# EAGLE board BMS (EAGLE 6.4), part 1 of 2
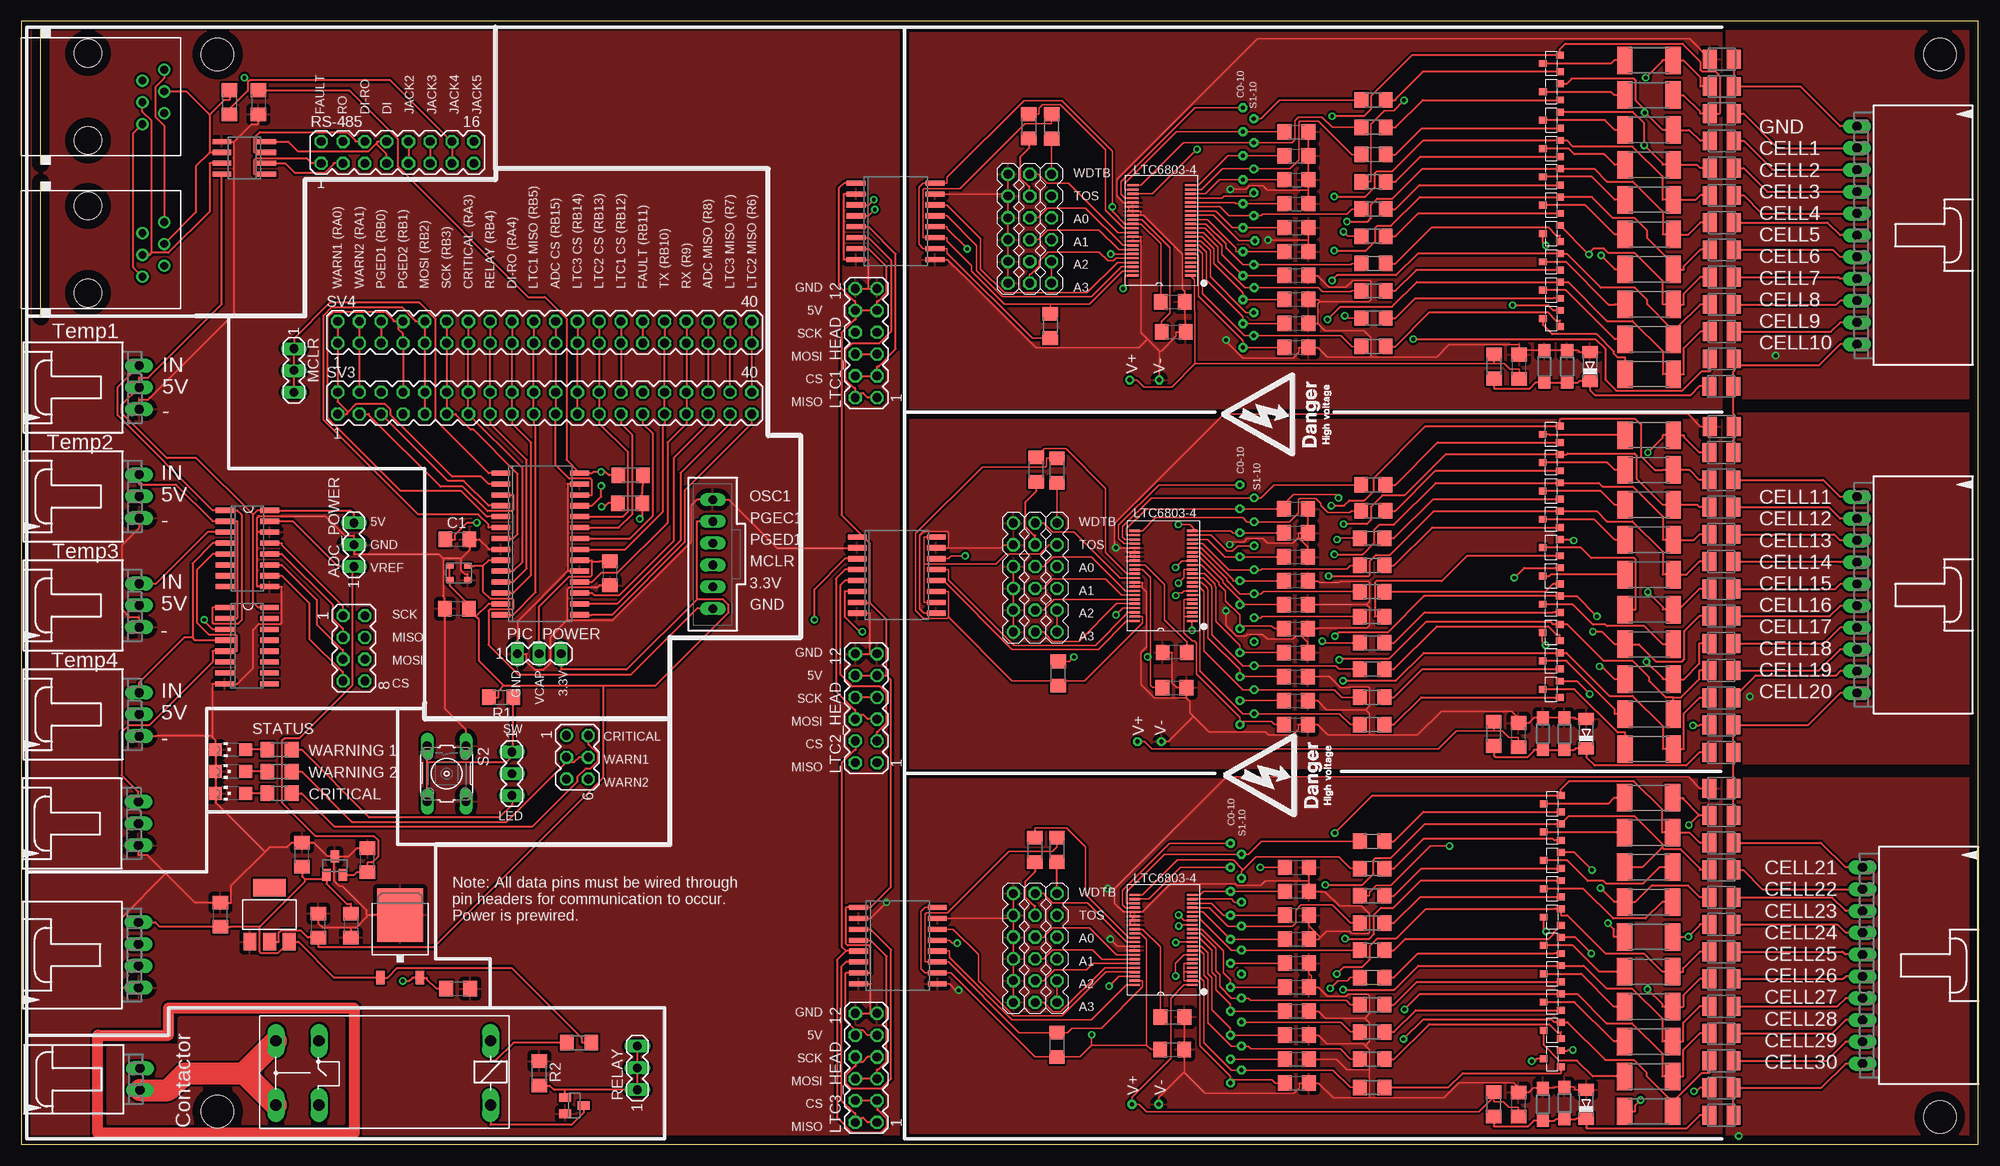
[diagram p12: board, top side]
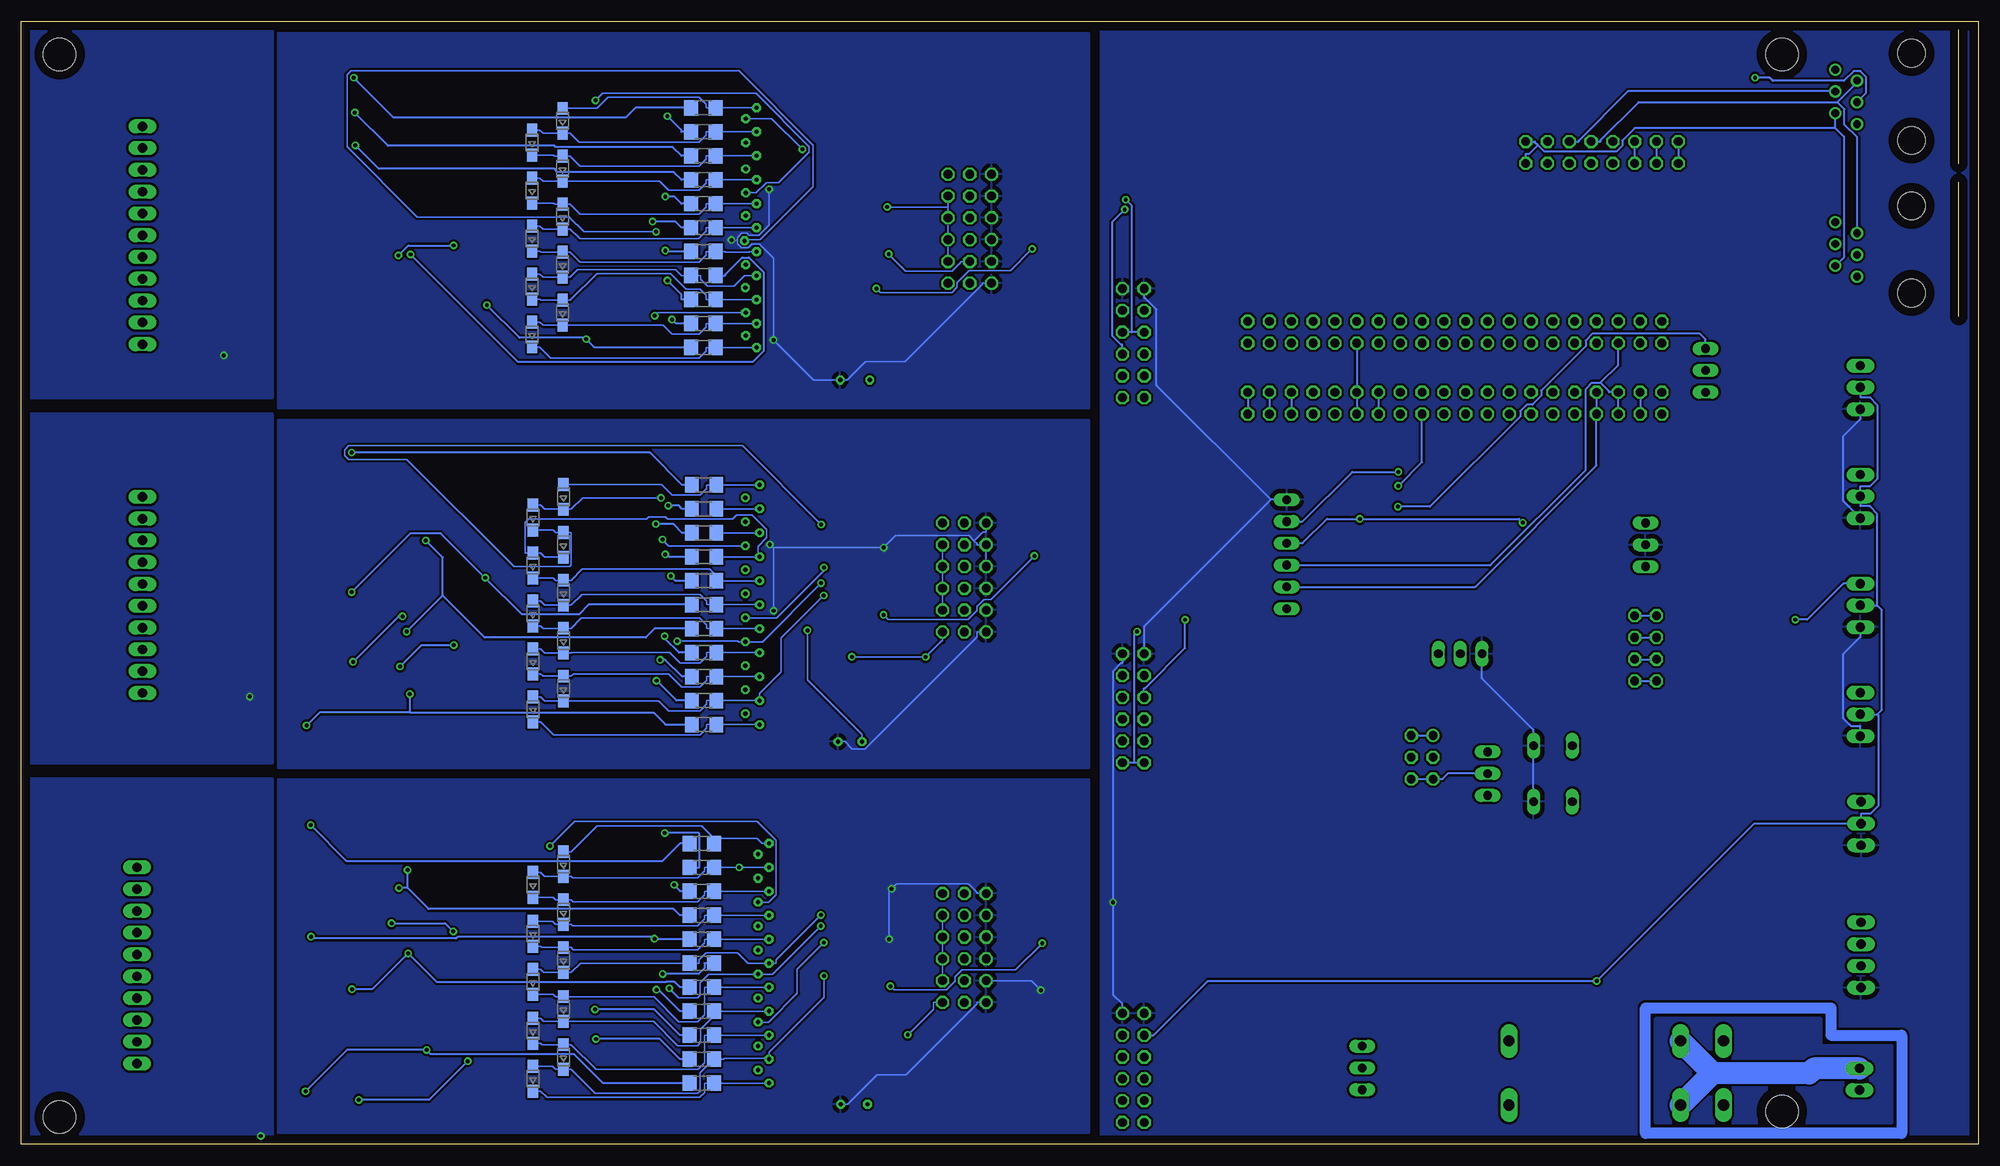
[diagram p13: board, bottom side, seen from below]

Size 227.97 x 130.84 mm. Coordinates in mm from the lower left corner, seen from the top.
Outline: 0,0 227.97,0 227.97,130.84 0,130.84 0,0
Copper layers (1*16): Top 0.035mm / dielectric 1.5mm / Bottom 0.035mm
Design rules "SJ Design Rules *": minimum track width 8mil, minimum drill 18mil, track to track 10mil, track to pad 8mil, pad to pad 8mil, via to via 10mil, smd to smd 8mil, copper to edge 40mil, drill to drill 10mil, minimum pad ring 10mil, minimum via ring 8mil, stop-mask expansion 4mil, vias tented up to drill 0mil, thermal gap 20mil
Net classes: 0 default: width 0.254 mm; 1 Mini: width 0.203 mm
Holes 3.81 mm at 223.52,127 223.52,3.17 22.86,3.81 22.86,127
bKeepout: 6 lines
tRestrict: 3 lines
bRestrict: 2 lines
vRestrict: area 139.2,38.6 to 153.1,47.5; area 139.7,80.2 to 152.7,89.8

## Footprints (pad centres in the part's own frame; a part is rotated, then mirrored left to right if it is on the bottom)
70553-04 = drill 1.092 long: 1 -3.81,-7.62; 2 -1.27,-7.62; 3 1.27,-7.62; 4 3.81,-7.62
MA04-2 = drill 1.016 octagon: 1 -3.81,-1.27; 2 -3.81,1.27; 3 -1.27,-1.27; 4 -1.27,1.27; 5 1.27,-1.27; 6 1.27,1.27; 7 3.81,-1.27; 8 3.81,1.27
MA03-1 = drill 1.016 long: 1 -2.54,0; 2 0,0; 3 2.54,0
70553-03 = drill 1.092 long: 1 -2.54,-7.62; 2 0,-7.62; 3 2.54,-7.62
C1206 = smd 1.6 x 1.8: 1 -1.4,0; 2 1.4,0
70553-10 = drill 1.092 long: 1 -11.43,-7.62; 2 -8.89,-7.62; 3 -6.35,-7.62; 4 -3.81,-7.62; 5 -1.27,-7.62; 6 1.27,-7.62; 7 3.81,-7.62; 8 6.35,-7.62; 9 8.89,-7.62; 10 11.43,-7.62
70553-02 = drill 1.092 long: 1 -1.27,-7.62; 2 1.27,-7.62
SOD323-W = smd 1.5 x 1.2: A 1.45,0; C -1.45,0
MINIMELF = smd 1.4 x 1.8: A 1.7,0; C -1.7,0
SOD123 = smd 1.4 x 1.4: A 1.9,0; C -1.9,0
70553-11 = drill 1.092 long: 1 -12.7,-7.62; 2 -10.16,-7.62; 3 -7.62,-7.62; 4 -5.08,-7.62; 5 -2.54,-7.62; 6 0,-7.62; 7 2.54,-7.62; 8 5.08,-7.62; 9 7.62,-7.62; 10 10.16,-7.62; 11 12.7,-7.62
SO16W = smd 0.6 x 2.2: 1 -4.445,-4.6; 2 -3.175,-4.6; 3 -1.905,-4.6; 4 -0.635,-4.6; 5 0.635,-4.6; 6 1.905,-4.6; 7 3.175,-4.6; 8 4.445,-4.6; 9 4.445,4.6; 10 3.175,4.6; 11 1.905,4.6; 12 0.635,4.6; 13 -0.635,4.6; 14 -1.905,4.6; 15 -3.175,4.6; 16 -4.445,4.6
TO252 = smd 1 x 1.6: 1 -2.28,-4.8; 2 2.28,-4.8 | smd 5.4 x 6.2: 3 0,2.5
SOT223 = smd 1.499 x 2.007: 1 -2.261,-3.15; 2 0.025,-3.15; 3 2.311,-3.15 | smd 3.81 x 2.007: 4 0,3.15
RJ11-NO_SHIELD = drill 0.9 pad 1.4: 1 -3.175,8.89; 2 -1.905,6.35; 3 -0.635,8.89; 4 0.635,6.35; 5 1.905,8.89; 6 3.175,6.35 | hole 3.251: -5.08,0; 5.08,0
G2REA = drill 1.321 long: 1 -2.54,-3.683; 2 -2.54,3.81; P 17.45,-3.683; P@ 17.45,3.81; S 22.454,-3.683; S@ 22.454,3.81
L3225M = smd 1.6 x 2.2: 1 -1.4,0; 2 1.4,0
MA03-2 = drill 1.016: 1 -2.54,-1.27 | drill 1.016 octagon: 2 -2.54,1.27; 3 0,-1.27; 4 0,1.27; 5 2.54,-1.27; 6 2.54,1.27
CHIPLED_1206 = smd 1.5 x 1.5: A 0,-1.75; C 0,1.75
SSOP44 = smd 0.25 x 1.25: P$1 -5.82,-3.33; P$2 -5.32,-3.33; P$3 -4.82,-3.33; P$4 -4.32,-3.33; P$5 -3.82,-3.33; P$6 -3.32,-3.33; P$7 -2.82,-3.33; P$8 -2.32,-3.33; P$9 -1.82,-3.33; P$10 -1.32,-3.33; P$11 -0.82,-3.33; P$12 -0.32,-3.33; P$13 0.18,-3.33; P$14 0.68,-3.33; P$15 1.18,-3.33; P$16 1.68,-3.33; P$17 2.18,-3.33; P$18 2.68,-3.33; P$19 3.18,-3.33; P$20 3.68,-3.33; P$21 4.18,-3.33; P$22 4.68,-3.33; P$23 4.68,3.37; P$24 4.18,3.37; P$25 3.68,3.37; P$26 3.18,3.37; P$27 2.68,3.37; P$28 2.18,3.37; P$29 1.68,3.37; P$30 1.18,3.37; P$31 0.68,3.37; P$32 0.18,3.37; P$33 -0.32,3.37; P$34 -0.82,3.37; P$35 -1.32,3.37; P$36 -1.82,3.37; P$37 -2.32,3.37; P$38 -2.82,3.37; P$39 -3.32,3.37; P$40 -3.82,3.37; P$41 -4.32,3.37; P$42 -4.82,3.37; P$43 -5.32,3.37; P$44 -5.82,3.37
20MIL = drill 0.508 octagon: P$1 0,0
MA06-2 = drill 1.016 octagon: 1 -6.35,-1.27; 2 -6.35,1.27; 3 -3.81,-1.27; 4 -3.81,1.27; 5 -1.27,-1.27; 6 -1.27,1.27; 7 1.27,-1.27; 8 1.27,1.27; 9 3.81,-1.27; 10 3.81,1.27; 11 6.35,-1.27; 12 6.35,1.27
70543-06 = drill 1.016 long: 1 -6.35,0; 2 -3.81,0; 3 -1.27,0; 4 1.27,0; 5 3.81,0; 6 6.35,0
MICRO3 = smd 0.8 x 0.9: 1 -0.95,-1; 2 0.95,-1; 3 0,1
R1206 = smd 1.6 x 1.803: 1 -1.422,0; 2 1.422,0
R2512 = smd 1.8 x 3.2: 1 -2.8,0; 2 2.8,0
MA08-2 = drill 1.016 octagon: 1 -8.89,-1.27; 2 -8.89,1.27; 3 -6.35,-1.27; 4 -6.35,1.27; 5 -3.81,-1.27; 6 -3.81,1.27; 7 -1.27,-1.27; 8 -1.27,1.27; 9 1.27,-1.27; 10 1.27,1.27; 11 3.81,-1.27; 12 3.81,1.27; 13 6.35,-1.27; 14 6.35,1.27; 15 8.89,-1.27; 16 8.89,1.27
B3F-10XX = drill 1.016 long: 1 -3.251,2.261; 2 3.251,2.261; 3 -3.251,-2.261; 4 3.251,-2.261
MA20-2 = drill 1.016 octagon: 1 -24.13,-1.27; 2 -24.13,1.27; 3 -21.59,-1.27; 4 -21.59,1.27; 5 -19.05,-1.27; 6 -19.05,1.27; 7 -16.51,-1.27; 8 -16.51,1.27; 9 -13.97,-1.27; 10 -13.97,1.27; 11 -11.43,-1.27; 12 -11.43,1.27; 13 -8.89,-1.27; 14 -8.89,1.27; 15 -6.35,-1.27; 16 -6.35,1.27; 17 -3.81,-1.27; 18 -3.81,1.27; 19 -1.27,-1.27; 20 -1.27,1.27; 21 1.27,-1.27; 22 1.27,1.27; 23 3.81,-1.27; 24 3.81,1.27; 25 6.35,-1.27; 26 6.35,1.27; 27 8.89,-1.27; 28 8.89,1.27; 29 11.43,-1.27; 30 11.43,1.27; 31 13.97,-1.27; 32 13.97,1.27; 33 16.51,-1.27; 34 16.51,1.27; 35 19.05,-1.27; 36 19.05,1.27; 37 21.59,-1.27; 38 21.59,1.27; 39 24.13,-1.27; 40 24.13,1.27
SOT23 = smd 1 x 1.4: 1 -0.95,-1.1; 2 0.95,-1.1; 3 0,1.1
SO16 = smd 0.6 x 2.2: 1 -4.445,-2.6; 2 -3.175,-2.6; 3 -1.905,-2.6; 4 -0.635,-2.6; 5 0.635,-2.6; 6 1.905,-2.6; 7 3.175,-2.6; 8 4.445,-2.6; 9 4.445,2.6; 10 3.175,2.6; 11 1.905,2.6; 12 0.635,2.6; 13 -0.635,2.6; 14 -1.905,2.6; 15 -3.175,2.6; 16 -4.445,2.6
SO28W = smd 0.6 x 2.2: 1 -8.255,-4.6; 2 -6.985,-4.6; 3 -5.715,-4.6; 4 -4.445,-4.6; 5 -3.175,-4.6; 6 -1.905,-4.6; 7 -0.635,-4.6; 8 0.635,-4.6; 9 1.905,-4.6; 10 3.175,-4.6; 11 4.445,-4.6; 12 5.715,-4.6; 13 6.985,-4.6; 14 8.255,-4.6; 15 8.255,4.6; 16 6.985,4.6; 17 5.715,4.6; 18 4.445,4.6; 19 3.175,4.6; 20 1.905,4.6; 21 0.635,4.6; 22 -0.635,4.6; 23 -1.905,4.6; 24 -3.175,4.6; 25 -4.445,4.6; 26 -5.715,4.6; 27 -6.985,4.6; 28 -8.255,4.6
ASE = smd 0.9 x 0.65: 1 -1.05,-0.825; 2 1.05,-0.825; 3 1.05,0.825; 4 -1.05,0.825
SO-08 = smd 0.6 x 2.2: 1 -1.905,-2.6; 2 -0.635,-2.6; 3 0.635,-2.6; 4 1.905,-2.6; 5 1.905,2.6; 6 0.635,2.6; 7 -0.635,2.6; 8 -1.905,2.6
3ROW_6POS = drill 1.016 octagon: 1 0,0; 2 2.54,0; 3 5.08,0; 4 0,-2.54; 5 2.54,-2.54; 6 5.08,-2.54; 7 0,-5.08; 8 2.54,-5.08; 9 5.08,-5.08; 10 0,-7.62; 11 2.54,-7.62; 12 5.08,-7.62; 13 0,-10.16; 14 2.54,-10.16; 15 5.08,-10.16; 16 0,-12.7; 17 2.54,-12.7; 18 5.08,-12.7

## Placement (x,y rotation side)
12V  C-GRID-04-70553  [70553-04]  6.02,22.05 90 top
ADC_BITS  [MA04-2]  38.73,57.78 270 top
ADC_POWER  [MA03-1]  38.73,69.85 90 top
AIN0  C-GRID-03-70553  [70553-03]  6.1,88.19 90 top
AIN1  C-GRID-03-70553  [70553-03]  6.1,75.49 90 top
AIN2  C-GRID-03-70553  [70553-03]  6.1,62.79 90 top
AIN3  C-GRID-03-70553  [70553-03]  6.1,50.09 90 top
AIN4  C-GRID-03-70553  [70553-03]  5.99,37.36 90 top
C1  1uF  [C1206]  50.8,70.48 0 top
C2  1uF  [C1206]  134.14,98.17 0 top
C4  100nF 100V  [C1206]  148.54,92.84 0 top
C5  100nF 100V  [C1206]  148.54,95.63 0 top
C6  100nF 100V  [C1206]  148.54,98.42 0 top
C7  100nF 100V  [C1206]  148.54,101.22 0 top
C8  100nF 100V  [C1206]  148.54,104.01 0 top
C9  100nF 100V  [C1206]  148.54,106.81 0 top
C10  100nF 100V  [C1206]  148.54,109.6 0 top
C11  100nF 100V  [C1206]  148.54,112.39 0 top
C12  100nF 100V  [C1206]  148.54,115.19 0 top
C13  100nF 100V  [C1206]  148.54,117.98 0 top
C14  100nF 100V  [C1206]  174.5,90.6 90 top
C15  1uF  [C1206]  134.24,94.64 0 top
C16  .1uF  [C1206]  27.61,121.41 270 top
C19  100nF 100V  [C1206]  148.49,48.9 0 top
C20  100nF 100V  [C1206]  148.49,51.69 0 top
C21  100nF 100V  [C1206]  148.49,54.48 0 top
C22  4.7uF  [C1206]  68.58,66.52 270 top
C23  100nF 100V  [C1206]  148.49,57.28 0 top
C24  100nF 100V  [C1206]  148.49,60.07 0 top
C25  100nF 100V  [C1206]  148.49,62.87 0 top
C26  100nF 100V  [C1206]  148.49,65.66 0 top
C27  100nF 100V  [C1206]  148.49,68.45 0 top
C28  100nF 100V  [C1206]  148.49,71.25 0 top
C29  100nF 100V  [C1206]  148.49,74.04 0 top
C30  100nF 100V  [C1206]  174.42,47.68 90 top
C31  1uF  [C1206]  134.34,53.21 0 top
C32  1uF  [C1206]  134.37,57.3 180 top
C35  100nF 100V  [C1206]  148.62,7.11 0 top
C36  100nF 100V  [C1206]  148.62,9.91 0 top
C37  100nF 100V  [C1206]  148.62,12.7 0 top
C38  100nF 100V  [C1206]  148.62,15.49 0 top
C39  100nF 100V  [C1206]  148.62,18.29 0 top
C40  100nF 100V  [C1206]  148.62,21.08 0 top
C41  100nF 100V  [C1206]  148.62,23.88 0 top
C42  100nF 100V  [C1206]  148.62,26.67 0 top
C43  100nF 100V  [C1206]  148.62,29.46 0 top
C44  100nF 100V  [C1206]  148.62,32.26 0 top
C45  100nF 100V  [C1206]  174.42,4.62 90 top
C46  1uF  [C1206]  134.09,11.05 0 top
C47  1uF  [C1206]  134.11,14.83 0 top
C48  .1uF  [C1206]  50.72,62.41 180 top
C49  .1uF  [C1206]  40.31,33.1 90 top
C50  1uF  [C1206]  32.69,33.73 90 top
C51  1uF  [C1206]  23.16,26.75 90 top
C52  .1uF  [C1206]  34.59,25.48 90 top
C53  1uF  [C1206]  38.4,25.48 270 top
C54  .1uF  [C1206]  50.88,18.11 0 top
CELLS-11-20  C-GRID-10-70553  [70553-10]  221.49,64.01 270 top
CELLS-21-30  C-GRID-10-70553  [70553-10]  222.12,20.83 270 top
CONTACTOR  C-GRID-02-70553  [70553-02]  6.2,7.57 90 top
D4  PDZ7.5B  [SOD323-W]  168.38,50.67 90 bottom
D6  PDZ7.5B  [SOD323-W]  168.48,94.36 90 bottom
D7  PDZ7.5B  [SOD323-W]  164.92,96.9 90 bottom
D8  PDZ7.5B  [SOD323-W]  168.48,99.95 90 bottom
D9  PDZ7.5B  [SOD323-W]  164.92,102.49 90 bottom
D10  PDZ7.5B  [SOD323-W]  168.48,105.54 90 bottom
D11  PDZ7.5B  [SOD323-W]  164.92,108.08 90 bottom
D12  PDZ7.5B  [SOD323-W]  168.48,111.12 90 bottom
D13  PDZ7.5B  [SOD323-W]  164.92,113.67 90 bottom
D14  PDZ7.5B  [SOD323-W]  168.48,116.71 90 bottom
D15  PDZ7.5B  [SOD323-W]  164.92,119.25 90 bottom
D16  ZMM5265B-7  [MINIMELF]  182.75,90.63 90 top
D17  BAT46W  [SOD123]  180.09,90.63 90 top
D18  BAT46W  [SOD123]  177.42,90.63 90 top
D19  PDZ7.5B  [SOD323-W]  164.82,53.09 90 bottom
D20  PDZ7.5B  [SOD323-W]  168.38,56.26 90 bottom
D21  PDZ7.5B  [SOD323-W]  164.82,58.67 90 bottom
D22  PDZ7.5B  [SOD323-W]  168.38,61.85 90 bottom
D23  PDZ7.5B  [SOD323-W]  164.82,64.26 90 bottom
D24  PDZ7.5B  [SOD323-W]  168.38,67.44 90 bottom
D25  PDZ7.5B  [SOD323-W]  164.82,69.85 90 bottom
D26  PDZ7.5B  [SOD323-W]  168.38,73.03 90 bottom
D27  PDZ7.5B  [SOD323-W]  164.82,75.44 90 bottom
D28  ZMM5265B-7  [MINIMELF]  182.32,47.83 90 top
D29  BAT46W  [SOD123]  179.78,47.83 90 top
D30  BAT46W  [SOD123]  177.24,47.83 90 top
D33  PDZ7.5B  [SOD323-W]  168.38,7.62 90 bottom
D34  PDZ7.5B  [SOD323-W]  164.82,10.16 90 bottom
D35  PDZ7.5B  [SOD323-W]  168.38,13.21 90 bottom
D36  PDZ7.5B  [SOD323-W]  164.82,15.75 90 bottom
D37  PDZ7.5B  [SOD323-W]  168.38,18.92 90 bottom
D38  PDZ7.5B  [SOD323-W]  164.82,21.46 90 bottom
D39  PDZ7.5B  [SOD323-W]  168.38,24.51 90 bottom
D40  PDZ7.5B  [SOD323-W]  164.82,27.05 90 bottom
D41  PDZ7.5B  [SOD323-W]  168.38,30.23 90 bottom
D42  PDZ7.5B  [SOD323-W]  164.82,32.64 90 bottom
D43  ZMM5265B-7  [MINIMELF]  182.32,4.65 90 top
D44  BAT46W  [SOD123]  177.24,4.65 90 top
D45  BAT46W  [SOD123]  179.78,4.8 90 top
GND-10  C-GRID-11-70553  [70553-11]  221.49,105.92 270 top
IC1  ADUM1401  [SO16W]  101.85,107.54 270 top
IC2  7805DT  [TO252]  44.12,24.21 0 top
IC2_\  ADUM1401  [SO16W]  101.98,66.32 270 top
IC3  REG1117  [SOT223]  28.88,26.75 0 top
IC3_  ADUM1401  [SO16W]  102.11,23.14 270 top
J19  RJ11-2L-B  [RJ11-NO_SHIELD]  7.75,122.05 270 top
J20  RJ11-2L-B  [RJ11-NO_SHIELD]  7.75,104.27 270 top
K1  G2REA  [G2REA]  52.12,8.36 180 top
L5  IMC1210ER100K  [L3225M]  198.12,91.52 180 top
L6  IMC1210ER100K  [L3225M]  198.12,94.69 180 top
L7  IMC1210ER100K  [L3225M]  198.12,97.87 180 top
L8  IMC1210ER100K  [L3225M]  198.12,101.04 180 top
L9  IMC1210ER100K  [L3225M]  198.12,104.22 180 top
L10  IMC1210ER100K  [L3225M]  198.12,107.39 180 top
L11  IMC1210ER100K  [L3225M]  198.12,110.57 180 top
L12  IMC1210ER100K  [L3225M]  198.12,113.74 180 top
L13  IMC1210ER100K  [L3225M]  198.12,116.92 180 top
L14  IMC1210ER100K  [L3225M]  198.12,120.09 180 top
L15  IMC1210ER100K  [L3225M]  198.04,88.32 180 top
L16  IMC1210ER100K  [L3225M]  198.12,126.44 180 top
L17  IMC1210ER100K  [L3225M]  198.12,123.27 180 top
L18  IMC1210ER100K  [L3225M]  198.04,48.84 180 top
L19  IMC1210ER100K  [L3225M]  198.04,52.02 180 top
L20  IMC1210ER100K  [L3225M]  198.04,55.19 180 top
L21  IMC1210ER100K  [L3225M]  198.04,58.37 180 top
L22  IMC1210ER100K  [L3225M]  198.04,61.54 180 top
L23  IMC1210ER100K  [L3225M]  198.04,64.72 180 top
L24  IMC1210ER100K  [L3225M]  198.04,67.89 180 top
L25  IMC1210ER100K  [L3225M]  198.04,71.07 180 top
L26  IMC1210ER100K  [L3225M]  198.04,74.24 180 top
L27  IMC1210ER100K  [L3225M]  198.04,77.42 180 top
L28  IMC1210ER100K  [L3225M]  198.04,45.67 180 top
L29  IMC1210ER100K  [L3225M]  198.12,83.64 180 top
L30  IMC1210ER100K  [L3225M]  198.04,80.59 180 top
L33  IMC1210ER100K  [L3225M]  198.07,6.55 180 top
L34  IMC1210ER100K  [L3225M]  198.07,9.73 180 top
L35  IMC1210ER100K  [L3225M]  198.07,12.9 180 top
L36  IMC1210ER100K  [L3225M]  198.07,16.08 180 top
L37  IMC1210ER100K  [L3225M]  198.07,19.25 180 top
L38  IMC1210ER100K  [L3225M]  198.07,22.43 180 top
L39  IMC1210ER100K  [L3225M]  198.07,25.6 180 top
L40  IMC1210ER100K  [L3225M]  198.07,28.78 180 top
L41  IMC1210ER100K  [L3225M]  198.07,31.95 180 top
L42  IMC1210ER100K  [L3225M]  198.07,35.13 180 top
L43  IMC1210ER100K  [L3225M]  198.07,3.38 180 top
L44  IMC1210ER100K  [L3225M]  198.07,41.48 180 top
L45  IMC1210ER100K  [L3225M]  198.07,38.3 180 top
LED  [MA03-2]  64.77,45.09 270 top
LED37  YELLOW  [CHIPLED_1206]  24.36,43.43 90 top
LED38  RED  [CHIPLED_1206]  24.36,40.89 90 top
LED40  YELLOW  [CHIPLED_1206]  24.36,45.97 90 top
LED_SWITCH  [MA03-1]  57.15,43.18 270 top
LTC1  LTC6803-4  [SSOP44]  132.87,107.06 90 top
LTC1_C0  TESTPAD-20MIL  [20MIL]  142.32,120.78 90 top
LTC1_C1  TESTPAD-20MIL  [20MIL]  142.32,117.98 90 top
LTC1_C2  TESTPAD-20MIL  [20MIL]  142.32,115.19 90 top
LTC1_C3  TESTPAD-20MIL  [20MIL]  142.32,112.39 90 top
LTC1_C4  TESTPAD-20MIL  [20MIL]  142.32,109.6 90 top
LTC1_C5  TESTPAD-20MIL  [20MIL]  142.32,106.81 90 top
LTC1_C6  TESTPAD-20MIL  [20MIL]  142.32,104.01 90 top
LTC1_C7  TESTPAD-20MIL  [20MIL]  142.32,101.22 90 top
LTC1_C8  TESTPAD-20MIL  [20MIL]  142.32,98.42 90 top
LTC1_C9  TESTPAD-20MIL  [20MIL]  142.32,95.63 90 top
LTC1_C10  TESTPAD-20MIL  [20MIL]  142.32,92.84 90 top
LTC1_HEAD  [MA06-2]  98.42,93.34 90 top
LTC1_S1  TESTPAD-20MIL  [20MIL]  143.59,119.51 90 top
LTC1_S2  TESTPAD-20MIL  [20MIL]  143.59,116.71 90 top
LTC1_S3  TESTPAD-20MIL  [20MIL]  143.59,113.67 90 top
LTC1_S4  TESTPAD-20MIL  [20MIL]  143.59,110.87 90 top
LTC1_S5  TESTPAD-20MIL  [20MIL]  143.59,108.2 90 top
LTC1_S6  TESTPAD-20MIL  [20MIL]  143.71,105.28 90 top
LTC1_S7  TESTPAD-20MIL  [20MIL]  143.59,102.49 90 top
LTC1_S8  TESTPAD-20MIL  [20MIL]  143.64,99.82 90 top
LTC1_S9  TESTPAD-20MIL  [20MIL]  143.59,96.9 90 top
LTC1_S10  TESTPAD-20MIL  [20MIL]  143.59,94.23 90 top
LTC1_V+  TESTPAD-20MIL  [20MIL]  129.13,89.05 180 top
LTC1_V-  TESTPAD-20MIL  [20MIL]  132.56,89.05 180 top
LTC2  LTC6803-4  [SSOP44]  133.07,66.8 90 top
LTC2_C0  TESTPAD-20MIL  [20MIL]  141.96,76.83 90 top
LTC2_C1  TESTPAD-20MIL  [20MIL]  141.96,74.04 90 top
LTC2_C2  TESTPAD-20MIL  [20MIL]  141.96,71.25 90 top
LTC2_C3  TESTPAD-20MIL  [20MIL]  141.96,68.45 90 top
LTC2_C4  TESTPAD-20MIL  [20MIL]  141.96,65.66 90 top
LTC2_C5  TESTPAD-20MIL  [20MIL]  141.96,62.87 90 top
LTC2_C6  TESTPAD-20MIL  [20MIL]  141.96,60.07 90 top
LTC2_C7  TESTPAD-20MIL  [20MIL]  141.96,57.28 90 top
LTC2_C8  TESTPAD-20MIL  [20MIL]  141.96,54.48 90 top
LTC2_C9  TESTPAD-20MIL  [20MIL]  141.96,51.69 90 top
LTC2_C10  TESTPAD-20MIL  [20MIL]  141.96,48.9 90 top
LTC2_HEAD  [MA06-2]  98.42,50.8 90 top
LTC2_S1  TESTPAD-20MIL  [20MIL]  143.61,75.31 90 top
LTC2_S2  TESTPAD-20MIL  [20MIL]  143.61,72.52 90 top
LTC2_S3  TESTPAD-20MIL  [20MIL]  143.61,69.72 90 top
LTC2_S4  TESTPAD-20MIL  [20MIL]  143.61,66.93 90 top
LTC2_S5  TESTPAD-20MIL  [20MIL]  143.61,64.14 90 top
LTC2_S6  TESTPAD-20MIL  [20MIL]  143.61,61.34 90 top
LTC2_S7  TESTPAD-20MIL  [20MIL]  143.61,58.55 90 top
LTC2_S8  TESTPAD-20MIL  [20MIL]  143.61,55.75 90 top
LTC2_S9  TESTPAD-20MIL  [20MIL]  143.61,52.96 90 top
LTC2_S10  TESTPAD-20MIL  [20MIL]  143.61,50.16 90 top
LTC2_V+  TESTPAD-20MIL  [20MIL]  130.02,46.91 180 top
LTC2_V-  TESTPAD-20MIL  [20MIL]  132.82,46.91 180 top
LTC3  LTC6803-4  [SSOP44]  133.07,24.38 90 top
LTC3_C0  TESTPAD-20MIL  [20MIL]  140.87,35.05 90 bottom
LTC3_C1  TESTPAD-20MIL  [20MIL]  140.87,32.26 90 bottom
LTC3_C2  TESTPAD-20MIL  [20MIL]  140.87,29.46 90 bottom
LTC3_C3  TESTPAD-20MIL  [20MIL]  140.87,26.67 90 bottom
LTC3_C4  TESTPAD-20MIL  [20MIL]  140.87,23.88 90 bottom
LTC3_C5  TESTPAD-20MIL  [20MIL]  140.87,21.08 90 bottom
LTC3_C6  TESTPAD-20MIL  [20MIL]  140.87,18.29 90 bottom
LTC3_C7  TESTPAD-20MIL  [20MIL]  140.87,15.49 90 bottom
LTC3_C8  TESTPAD-20MIL  [20MIL]  140.87,12.7 90 bottom
LTC3_C9  TESTPAD-20MIL  [20MIL]  140.87,9.91 90 bottom
LTC3_C10  TESTPAD-20MIL  [20MIL]  140.87,7.11 90 bottom
LTC3_HEAD  [MA06-2]  98.42,8.89 90 top
LTC3_S1  TESTPAD-20MIL  [20MIL]  142.14,33.78 90 bottom
LTC3_S2  TESTPAD-20MIL  [20MIL]  142.14,30.99 90 bottom
LTC3_S3  TESTPAD-20MIL  [20MIL]  142.14,28.19 90 bottom
LTC3_S4  TESTPAD-20MIL  [20MIL]  142.14,25.4 90 bottom
LTC3_S5  TESTPAD-20MIL  [20MIL]  142.14,22.61 90 bottom
LTC3_S6  TESTPAD-20MIL  [20MIL]  142.14,19.81 90 bottom
LTC3_S7  TESTPAD-20MIL  [20MIL]  142.14,17.02 90 bottom
LTC3_S8  TESTPAD-20MIL  [20MIL]  142.14,14.22 90 bottom
LTC3_S9  TESTPAD-20MIL  [20MIL]  142.14,11.43 90 bottom
LTC3_S10  TESTPAD-20MIL  [20MIL]  142.14,8.64 90 bottom
LTC3_V+  TESTPAD-20MIL  [20MIL]  129.39,4.65 180 top
LTC3_V-  TESTPAD-20MIL  [20MIL]  132.51,4.65 90 top
MCLR  [MA03-1]  31.75,90.17 270 top
PIC_POWER  [MA03-1]  60.33,57.15 0 top
PROGRAM  C-GRID-06-70543  [70543-06]  80.54,68.76 90 top
Q3  SI2351DS  [MICRO3]  178.26,96.22 90 top
Q4  SI2351DS  [MICRO3]  178.26,99.52 90 top
Q5  SI2351DS  [MICRO3]  178.26,102.82 90 top
Q6  SI2351DS  [MICRO3]  178.26,106.12 90 top
Q7  SI2351DS  [MICRO3]  178.26,109.42 90 top
Q8  SI2351DS  [MICRO3]  178.26,112.73 90 top
Q9  SI2351DS  [MICRO3]  178.26,116.03 90 top
Q10  SI2351DS  [MICRO3]  178.26,119.33 90 top
Q11  SI2351DS  [MICRO3]  178.26,122.63 90 top
Q12  SI2351DS  [MICRO3]  178.26,125.93 90 top
Q15  SI2351DS  [MICRO3]  178.23,53.01 90 top
Q16  SI2351DS  [MICRO3]  178.23,56.31 90 top
Q17  SI2351DS  [MICRO3]  178.23,59.61 90 top
Q18  SI2351DS  [MICRO3]  178.23,62.92 90 top
Q19  SI2351DS  [MICRO3]  178.23,69.52 90 top
Q20  SI2351DS  [MICRO3]  178.23,66.22 90 top
Q21  SI2351DS  [MICRO3]  178.23,72.82 90 top
Q22  SI2351DS  [MICRO3]  178.23,76.12 90 top
Q23  SI2351DS  [MICRO3]  178.23,79.43 90 top
Q24  SI2351DS  [MICRO3]  178.23,82.73 90 top
Q27  SI2351DS  [MICRO3]  178.36,9.96 90 top
Q28  SI2351DS  [MICRO3]  178.36,13.26 90 top
Q29  SI2351DS  [MICRO3]  178.36,16.56 90 top
Q30  SI2351DS  [MICRO3]  178.36,19.86 90 top
Q31  SI2351DS  [MICRO3]  178.36,23.16 90 top
Q32  SI2351DS  [MICRO3]  178.36,26.47 90 top
Q33  SI2351DS  [MICRO3]  178.36,29.77 90 top
Q34  SI2351DS  [MICRO3]  178.36,33.07 90 top
Q35  SI2351DS  [MICRO3]  178.36,36.37 90 top
Q36  SI2351DS  [MICRO3]  178.36,39.67 90 top
R1  10K  [R1206]  55.88,52.07 180 top
R2  10k  [R1206]  60.33,8.26 270 top
R5  1M  [R1206]  117.37,118.62 270 top
R10  100 1%  [R1206]  148.51,92.84 0 bottom
R11  3.3K  [R1206]  157.53,92.96 180 top
R12  33 1W  [R2512]  189.66,89.74 180 top
R14  100 1%  [R1206]  148.51,95.63 0 bottom
R15  3.3K  [R1206]  157.53,96.27 180 top
R16  33 1W  [R2512]  189.66,93.8 180 top
R18  100 1%  [R1206]  148.51,98.42 0 bottom
R19  3.3K  [R1206]  157.53,99.44 180 top
R20  33 1W  [R2512]  189.66,97.87 180 top
R22  100 1%  [R1206]  148.51,101.22 180 bottom
R23  3.3K  [R1206]  157.53,102.62 180 top
R24  33 1W  [R2512]  189.66,101.93 180 top
R26  100 1%  [R1206]  148.51,104.01 0 bottom
R27  3.3K  [R1206]  157.53,105.79 180 top
R28  33 1W  [R2512]  189.66,105.99 180 top
R30  100 1%  [R1206]  148.51,106.81 0 bottom
R31  3.3K  [R1206]  157.53,108.97 180 top
R32  33 1W  [R2512]  189.66,110.06 180 top
R34  100 1%  [R1206]  148.51,109.6 0 bottom
R35  3.3K  [R1206]  157.53,112.14 180 top
R36  33 1W  [R2512]  189.66,114.12 180 top
R38  100 1%  [R1206]  148.51,112.39 0 bottom
R39  3.3K  [R1206]  157.53,115.32 180 top
R40  33 1W  [R2512]  189.66,118.19 180 top
R42  100 1%  [R1206]  148.51,115.19 0 bottom
R43  3.3K  [R1206]  157.53,118.49 180 top
R44  33 1W  [R2512]  189.61,122.25 180 top
R46  100 1%  [R1206]  148.51,117.98 0 bottom
R47  3.3K  [R1206]  157.53,121.67 180 top
R48  33 1W  [R2512]  189.61,126.31 180 top
R50  100  [R1206]  171.58,90.63 90 top
R51  100 1%  [R1206]  148.51,120.78 0 bottom
R52  10k\  [R1206]  70.97,77.95 0 top
R53  470  [R1206]  70.92,74.7 180 top
R62  100 1%  [R1206]  148.44,48.9 0 bottom
R63  3.3K  [R1206]  157.38,48.9 180 top
R64  33 1W  [R2512]  189.66,46.05 180 top
R66  100 1%  [R1206]  148.44,51.69 0 bottom
R67  3.3K  [R1206]  157.38,52.07 180 top
R68  33 1W  [R2512]  189.66,50.11 180 top
R70  100 1%  [R1206]  148.44,54.48 0 bottom
R71  3.3K  [R1206]  157.38,55.37 180 top
R72  33 1W  [R2512]  189.66,54.18 180 top
R74  100 1%  [R1206]  148.44,57.28 0 bottom
R75  3.3K  [R1206]  157.38,58.42 180 top
R76  33 1W  [R2512]  189.66,58.24 0 top
R78  100 1%  [R1206]  148.44,60.07 0 bottom
R79  3.3K  [R1206]  157.38,61.47 180 top
R80  33 1W  [R2512]  189.66,62.31 180 top
R82  100 1%  [R1206]  148.44,62.87 0 bottom
R83  3.3K  [R1206]  157.38,64.39 180 top
R84  33 1W  [R2512]  189.66,66.37 180 top
R86  100 1%  [R1206]  148.44,65.66 0 bottom
R87  3.3K  [R1206]  157.38,67.44 180 top
R88  33 1W  [R2512]  189.66,70.43 180 top
R90  100 1%  [R1206]  148.44,68.45 0 bottom
R91  3.3K  [R1206]  157.38,70.61 180 top
R92  33 1W  [R2512]  189.66,74.5 180 top
R94  100 1%  [R1206]  148.44,71.25 0 bottom
R95  3.3K  [R1206]  157.51,73.79 180 top
R96  33 1W  [R2512]  189.66,78.56 180 top
R98  100 1%  [R1206]  148.44,74.04 0 bottom
R99  3.3K  [R1206]  157.51,76.83 180 top
R100  33 1W  [R2512]  189.66,82.63 180 top
R102  100  [R1206]  171.53,47.83 90 top
R103  100 1%  [R1206]  148.44,76.83 0 bottom
R104  1M  [R1206]  118.21,78.61 270 top
R113  100 1%  [R1206]  148.69,7.11 0 bottom
R114  3.3K  [R1206]  157.38,6.6 180 top
R115  33 1W  [R2512]  189.59,3.84 180 top
R117  100 1%  [R1206]  148.69,9.91 0 bottom
R118  3.3K  [R1206]  157.38,9.91 180 top
R119  33 1W  [R2512]  189.59,7.9 180 top
R121  100 1%  [R1206]  148.69,12.7 0 bottom
R122  3.3K  [R1206]  157.38,13.08 180 top
R123  33 1W  [R2512]  189.59,11.96 180 top
R125  100 1%  [R1206]  148.69,15.49 0 bottom
R126  3.3K  [R1206]  157.38,16.26 180 top
R127  33 1W  [R2512]  189.59,16.03 180 top
R129  100 1%  [R1206]  148.69,18.29 0 bottom
R130  3.3K  [R1206]  157.38,19.43 180 top
R131  33 1W  [R2512]  189.59,20.09 180 top
R133  100 1%  [R1206]  148.69,21.08 180 bottom
R134  3.3K  [R1206]  157.38,22.61 180 top
R135  33 1W  [R2512]  189.59,24.16 180 top
R137  100 1%  [R1206]  148.69,23.88 0 bottom
R138  3.3K  [R1206]  157.38,25.78 180 top
R139  33 1W  [R2512]  189.59,28.22 0 top
R141  100 1%  [R1206]  148.69,26.67 0 bottom
R142  3.3K  [R1206]  157.38,28.96 180 top
R143  33 1W  [R2512]  189.59,32.28 0 top
R145  100 1%  [R1206]  148.69,29.46 0 bottom
R146  3.3K  [R1206]  157.38,32.13 180 top
R147  33 1W  [R2512]  189.59,36.32 180 top
R149  100 1%  [R1206]  148.69,32.26 0 bottom
R150  3.3K  [R1206]  157.38,35.31 180 top
R151  33 1W  [R2512]  189.59,40.36 180 top
R153  100  [R1206]  171.53,4.65 90 top
R154  100 1%  [R1206]  148.69,35.05 0 bottom
R155  1M  [R1206]  118.08,34.29 270 top
R156  62  [R1206]  30.07,40.89 0 top
R157  62  [R1206]  30.07,43.43 0 top
R158  62  [R1206]  30.07,45.97 0 top
R163  1M  [R1206]  120.65,11.58 90 top
R164  1M  [R1206]  120.65,34.32 90 top
R165  1M  [R1206]  120.78,54.84 270 top
R166  1M  [R1206]  120.65,78.51 90 top
R167  1M  [R1206]  119.89,95.35 90 top
R168  1M  [R1206]  120.02,118.59 90 top
R169  100  [R1206]  64.97,11.84 0 top
R170  120  [R1206]  24.26,121.41 270 top
RELAY  [MA03-1]  71.75,8.89 90 top
RS-485  [MA08-2]  43.81,115.57 0 top
S2  [B3F-10XX]  49.53,43.18 270 top
SV3  [MA20-2]  60.96,86.36 0 top
SV4  [MA20-2]  60.96,94.61 0 top
T1  PMV56XN  [SOT23]  64.41,4.5 270 top
U$1  SP720APP  [SO16]  26.29,58.09 270 top
U$2  PIC24HJ128GP-202  [SO28W]  60.45,69.95 270 top
U$3  ASE  [ASE]  50.95,66.57 0 top
U$4  MAX3440E  [SO-08]  25.96,114.94 90 top
U$6  MCP-3008  [SO16]  26.31,69.42 270 top
U$7  MAX6105  [SOT23]  36.5,32.46 0 top
U$8  3ROW_6POS  [3ROW_6POS]  114.94,113.03 0 top
U$9  3ROW_6POS  [3ROW_6POS]  115.57,72.39 0 top
U$10  3ROW_6POS  [3ROW_6POS]  115.57,29.21 0 top

## Tracks (layer width: path | path; a pad name or v marks a point on that pad's centre or on a via)
12V
  Top 0.254: 33.05,30.85 32.69,31.2 C50.1 | 35.55,30.85 33.05,30.85 | 27.76,25.35 33.05,30.63 33.05,30.85 | 27.76,25.35 24.39,25.35 C51.1 16.12,25.35 15.61,25.86 12V.4 | 27.76,25.35 27.76,22.45 27.95,22.26 29.86,22.26 IC3.3 32.27,23.6 36.46,19.41 IC2.1 42.26,19.41 42.67,19.41 43.8,20.54 57.13,20.54 65.27,12.4 65.27,11.84 R169.2 | 35.55,30.85 35.55,30.33 37.87,28.01 38.41,28.01 C53.1 | U$7.1 35.55,30.85
+3V3  (via drill 0.46 pad 0.86)
  Top 0.254: C16.1 38.17,122.81 43.81,117.17 43.81,113.95 59.03,98.73 60.99,98.73 63.5,96.22 63.5,79.76 U$2.28 66.48,78.21 66.62,78.35 v67.53,78.35 68.02,78.35 68.42,77.95 R52.1 | U$3.4 U$3.1 49.9,65.09 49.91,65.09 52.12,62.88 C48.1 52.99,61.54 | 78.69,63.5 70.48,55.3 62.87,55.3 PIC_POWER.3 | 67.75,53.44 73.88,53.44 82.4,61.95 82.4,62.86 81.76,63.5 78.69,63.5 | 78.69,63.5 78.69,72.57 PROGRAM.5 | 56.19,53.44 67.75,53.44 | 67.75,53.44 67.75,42.69 48.01,22.95 34.59,22.95 C52.1 34.35,24.08 33.98,24.08 33.36,24.08 32.51,24.93 30.24,24.93 29.98,24.68 29.98,23.6 IC3.2 | 56.19,53.44 53.3,56.33 53.3,61.13 52.99,61.44 52.99,61.54 | 52.99,61.54 | 56.19,53.44 55.59,52.84 55.59,52.07 R1.2 | 52.99,61.54 54.42,62.97 U$2.13
  Bottom 0.254: v67.53,78.35 72.91,78.35 78.69,72.57 PROGRAM.5
+5V  (via drill 0.46 pad 0.86)
  Top 0.254: 97.16,13.25 96.01,14.39 96.01,19.9 96.08,19.96 IC3_.7 98.94,19.96 98.94,22.95 98.75,23.14 96.27,23.14 96.08,23.34 96.08,27.58 IC3_.1 98.94,27.58 101.31,29.96 101.31,54.09 100.79,54.61 | 97.16,13.25 98.06,13.25 98.6,12.7 LTC3_HEAD.9 | 100.79,54.61 100.79,61.17 98.81,63.14 | 98.1,70.76 98.81,70.05 98.81,63.14 | IC2_\.7 98.81,63.14 | 26.97,73.35 20.37,79.95 16.94,79.95 11.71,85.19 11.71,86.18 AIN0.2 13.72,89.34 14.79,89.34 23.36,97.9 U$4.8 | 26.97,73.35 27.48,73.86 U$6.16 38.35,73.86 38.73,73.48 ADC_POWER.3 | 26.97,73.35 26.97,63.15 27.59,62.53 U$1.16 | v44.42,19.02 45.18,19.02 45.57,19.41 IC2.2 47.23,19.41 47.23,19.23 48.35,18.11 C54.1 | LTC3_HEAD.10 97.16,13.25 | 98.1,70.76 95.54,73.33 95.54,94.56 97.04,96.06 97.16,96.06 LTC1_HEAD.10 | 100.79,54.61 LTC2_HEAD.9 LTC2_HEAD.10 | LTC1_HEAD.10 97.16,98.25 97.02,98.25 95.28,99.99 95.28,111.44 95.82,111.99 IC1.1 | IC2_\.1 98.1,70.76 | LTC1_HEAD.10 LTC1_HEAD.9 99.69,98.25 99.83,98.25 100.81,99.22 100.81,102.25 98.68,104.37 IC1.7
  Bottom 0.254: AIN0.2 13.72,87.04 12.64,87.04 11.75,86.15 11.75,77.53 12.64,76.64 13.72,76.64 AIN1.2 13.72,74.34 12.64,74.34 11.75,73.45 11.75,62.79 | 11.74,50.09 11.62,49.98 11.62,39.43 12.54,38.51 13.61,38.51 AIN4.2 26.08,37.36 v44.42,19.02 89.74,19.02 96.06,12.7 LTC3_HEAD.10 | 11.74,50.09 11.75,50.09 AIN3.2 | 11.74,50.09 11.21,50.62 11.21,62.25 11.75,62.79 | 11.75,62.79 11.87,62.79 AIN2.2
A0
  Top 0.203: LTC1.P$37 128.32,104.74 124,109.07 119.55,109.07 118.54,108.06 118.54,107.95 U$8.8
A1
  Top 0.203: U$8.11 118.54,105.41 118.54,105.54 119.53,106.53 125.56,106.53 127.85,104.24 LTC1.P$38
A2  (via drill 0.46 pad 0.86)
  Top 0.203: v126.91,103.74 LTC1.P$39
  Bottom 0.203: U$8.14 118.54,102.87 118.54,102.74 119.52,101.76 124.93,101.76 v126.91,103.74
A3
  Top 0.203: LTC1.P$40 127.53,103.24 127.24,102.95 126.59,102.95 125.57,103.97 119.6,103.97 118.54,102.91 118.54,102.33 117.61,101.4 117.47,101.4 U$8.17
ADC_CS
  Top 0.254: U$2.26 66.48,75.67 66.48,77.38 66.29,77.57 63.82,77.57 62.23,79.16 SV3.21 SV3.22 SV4.21 SV4.22
ADC_CS_ADC
  Top 0.254: ADC_BITS.7 37.47,55.07 37.35,55.07 33.54,58.88 33.54,63.05 30.34,66.24 U$6.10
  Bottom 0.254: ADC_BITS.8 ADC_BITS.7
ADC_MISO
  Top 0.254: SV3.35 80.01,84 76.02,80 76.02,70.33 69.68,63.99 66.73,63.99 66.48,64.24 U$2.17 | SV3.36 SV4.35 SV4.36
  Bottom 0.254: SV3.36 SV3.35
ADC_MISO_ADC
  Top 0.254: ADC_BITS.3 37.47,60.15 37.35,60.15 36.26,61.24 36.26,62.87 30.34,68.78 U$6.12
  Bottom 0.254: ADC_BITS.4 ADC_BITS.3
ADC_SCK
  Top 0.254: ADC_BITS.1 37.47,62.69 30.34,69.81 30.34,70.05 U$6.13
  Bottom 0.254: ADC_BITS.2 ADC_BITS.1
AGND  (via drill 0.46 pad 0.86)
  Top 0.203: C26.2 150.99,65.66 151.22,65.43 153.5,65.43 153.66,65.6 156.93,65.6 157.06,65.46 157.06,63.21 156.72,62.87 | 156.72,62.87 C25.2 | 156.72,62.87 157.06,62.52 157.06,60.42 156.77,60.13 151.06,60.13 150.99,60.07 C24.2 149.09,59.28 | 156.64,50.62 157.06,51.04 157.06,53.16 156.92,53.3 154.81,53.3 154.72,53.2 153.68,53.2 152.4,54.48 150.99,54.48 C21.2 | v140.34,62.16 140.34,60.45 141.56,59.23 142.64,59.23 142.83,59.42 144.61,59.42 145.17,58.87 148.13,58.87 148.51,59.24 149.06,59.24 149.09,59.28 | 149.09,59.28 149.89,58.48 C23.2 | 148.78,70.69 148.78,71.25 C28.2 C29.2 | 148.78,70.69 149.82,69.66 149.89,69.66 C27.2 | v140.78,69.89 141.07,70.18 142.42,70.18 142.8,70.56 144.65,70.56 145.17,70.04 148.13,70.04 148.78,70.69 | L29.2 195.62,83.64 194.19,85.07 140.09,85.07 127.34,72.32 127.34,69.68 v127.51,69.51 127.54,69.48 128.77,69.48 | 156.64,50.62 152.06,50.62 150.99,51.69 C20.2 | 157.06,47.69 157.06,50.2 156.64,50.62 | 157.06,47.69 152.2,47.69 150.99,48.9 C19.2 148.78,48.9 148.78,48.34 148.13,47.69 145.27,47.69 144.93,48.04 138.35,48.04 136.55,49.84 | 175.02,49.08 173.67,50.43 165.41,50.43 162.67,47.69 157.06,47.69 | 130.45,64.98 131.09,64.35 131.09,57.95 130.41,57.27 130.41,53.59 131.99,52.01 135.74,52.01 | 130.45,64.98 130.17,64.98 LTC2.P$36 | 130.45,64.98 130.63,65.16 130.63,65.48 LTC2.P$35 | 136.55,49.84 136.15,50.24 136.15,51.6 135.74,52.01 | 136.55,49.84 133.63,46.91 LTC2_V-.P$1 | 135.74,52.01 C31.2 134.64,53.21 134.07,53.78 134.07,57.3 C32.2 | 129.24,68.98 128.77,68.98 128.77,69.48 | LTC2.P$28 129.24,68.98 | 129.24,68.48 128.77,68.48 128.77,67.98 LTC2.P$30
  Top 0.203: LTC2.P$29 129.24,68.48 | 129.24,68.48 129.24,68.98 | U$9.4 114.5,69.85 114.15,69.49 107.99,69.49 | 175.02,49.08 175.63,49.08 176.24,49.69 176.24,49.73 D30.A D29.A 180.92,49.73 181.12,49.53 D28.A | C30.2 175.02,49.08 | IC2_\.9 105.18,61.87 104.66,62.39 104.66,70.9 105.13,71.37 107.88,71.37 107.99,71.27 107.99,69.49 | LTC2.P$27 128.77,69.48 | IC2_\.15 107.99,69.49 | U$9.7 U$9.10 U$9.13 U$9.16
  Bottom 0.203: LTC2_V-.P$1 132,46.91 131.18,46.09 129.66,46.09 116.64,59.11 116.64,59.69 U$9.16 | 140.34,69.51 140.4,69.51 v140.78,69.89 | 140.34,69.51 v127.51,69.51 126.1,70.92 117.58,70.92 116.95,70.3 | v140.34,62.16 140.34,69.51 | U$9.1 115.57,71.32 115.93,71.32 116.95,70.3 | 116.95,70.3 116.64,69.98 116.64,69.85 U$9.4 U$9.7
  pour Bottom: 103.5,84.45 198.12,84.45 198.12,43.81 103.5,43.81
  pour Top: 103.5,84.45 198.12,84.45 198.12,43.81 103.5,43.81
C22
  Top 0.254: U$2.20 66.48,68.05 66.48,67.92 | 66.48,67.92 | PIC_POWER.2 60.33,62.68 63.78,66.14 66.28,66.14 66.48,66.34 66.48,67.92 | 66.48,67.92 67.35,67.92 C22.1
CELL0
  Top 0.254: GND-10.1 211.9,118.62 207.25,123.27 L17.1 L16.1
CELL1
  Top 0.254: L14.1 200.65,120.09 204.66,116.08 GND-10.2
CELL2
  Top 0.254: L13.1 200.65,116.92 204.03,113.54 GND-10.3
CELL3
  Top 0.254: L12.1 200.65,113.74 203.39,111 GND-10.4
CELL4
  Top 0.254: L11.1 200.65,110.57 202.76,108.46 GND-10.5
CELL5
  Top 0.254: GND-10.6 211.9,105.92 210.43,107.39 L10.1
CELL6
  Top 0.254: GND-10.7 211.9,103.38 211.06,104.22 L9.1
CELL7
  Top 0.254: GND-10.8 211.9,100.84 211.7,101.04 L8.1
CELL8
  Top 0.254: GND-10.9 211.9,98.3 211.47,97.87 L7.1
CELL9
  Top 0.254: GND-10.10 211.9,95.76 210.83,94.69 L6.1
CELL10
  Top 0.254: GND-10.11 211.9,93.22 209.48,90.8 199.52,90.8 | 199.52,90.8 199.52,90.09 199.44,90.01 L15.1 199.44,85.15 199.52,85.07 L29.1 199.52,82.1 199.44,82.03 L30.1 | L5.1 199.52,90.8
CELL11
  Top 0.254: CELLS-11-20.1 211.9,75.44 209.92,77.42 L27.1
CELL12
  Top 0.254: CELLS-11-20.2 211.9,72.9 210.55,74.24 L26.1
CELL13
  Top 0.254: CELLS-11-20.3 211.9,70.36 211.19,71.07 L25.1
CELL14
  Top 0.254: CELLS-11-20.4 211.9,67.82 211.82,67.89 L24.1
CELL15
  Top 0.254: CELLS-11-20.5 211.9,65.28 211.34,64.72 L23.1
CELL16
  Top 0.254: CELLS-11-20.6 211.9,62.74 210.71,61.54 L22.1
CELL17
  Top 0.254: CELLS-11-20.7 211.9,60.2 210.07,58.37 L21.1
CELL18
  Top 0.254: CELLS-11-20.8 211.9,57.66 209.44,55.19 L20.1
CELL19
  Top 0.254: CELLS-11-20.9 211.9,55.12 211.42,54.64 202.07,54.64 L19.1
CELL20
  Top 0.254: CELLS-11-20.10 211.9,52.58 208.17,48.84 L18.1 L28.1 199.44,44.24 199.47,44.21 L44.1 L45.1
CELL21
  Top 0.254: CELLS-21-30.1 212.53,32.26 209.66,35.13 L42.1
CELL22
  Top 0.254: L41.1 200.6,31.95 202.84,29.72 CELLS-21-30.2
CELL23
  Top 0.254: CELLS-21-30.3 212.53,27.18 210.93,28.78 L40.1
CELL24
  Top 0.254: CELLS-21-30.4 212.53,24.64 211.57,25.6 L39.1
CELL25
  Top 0.254: CELLS-21-30.5 212.53,22.1 212.2,22.43 L38.1
CELL26
  Top 0.254: CELLS-21-30.6 212.53,19.56 212.23,19.25 L37.1
CELL27
  Top 0.254: CELLS-21-30.7 212.53,17.02 211.59,16.08 L36.1
CELL28
  Top 0.254: CELLS-21-30.8 212.53,14.48 210.96,12.9 L35.1
CELL29
  Top 0.254: CELLS-21-30.9 212.53,11.94 210.32,9.73 L34.1
CELL30
  Top 0.254: CELLS-21-30.10 212.53,9.4 209.69,6.55 L33.1 L43.1
CRITICAL
  Top 0.254: U$2.10 57.28,66.78 58.36,67.86 58.36,78.8 SV3.13 SV3.14 SV4.13 SV4.14
CRITICAL_LED
  Top 0.254: R156.2 32.63,40.89 36.46,37.06 59.57,37.06 64.81,42.3 64.81,42.86 65.76,43.81 66.33,43.81 67.18,44.67 67.18,45.51 66.15,46.53 66.04,46.53 LED.2
  Bottom 0.254: LED.2 LED.1
DI-RO
  Top 0.254: U$2.12 57.28,64.24 59.39,66.35 59.39,81.76 57.15,84 SV3.17 SV3.18 SV4.17 SV4.18
FAULT
  Top 0.254: SV3.29 72.39,84 73.57,82.82 73.57,73.25 70.91,70.59 66.48,70.59 U$2.22 | SV4.30 SV4.29
  Bottom 0.254: SV3.29 SV3.30 SV4.29
GND  (via drill 0.46 pad 0.86)
  Top 0.203: 149.94,105.36 C9.2 | C8.2 149.94,105.36 | v145.25,105.36 149.94,105.36 | 149.94,111.19 C10.2 | 151.28,98.19 157.01,98.19 157.21,98.4 157.21,100.52 157.09,100.65 155.1,100.65 154.32,99.87 152.31,99.87 151.04,101.14 151.04,101.22 C7.2 | 149.94,111.19 C11.2 C12.2 C13.2 | v140.85,111.27 142.65,111.27 143.09,111.71 144.66,111.71 145.18,111.19 149.94,111.19 | 151.28,98.19 151.04,98.42 C6.2 | 151.04,95.63 151.04,97.95 151.28,98.19 | 157.25,91.74 157.25,93.97 156.4,94.82 151.86,94.82 151.04,95.63 | 131.19,93.81 130.43,94.58 130.43,105.24 130.25,105.24 | IC1.9 107.86,103.1 109.63,101.33 109.72,101.33 118.23,92.82 130.21,92.82 131.19,93.81 | 132.56,92.44 131.19,93.81 | 130.25,105.24 130.43,105.42 130.43,105.74 LTC1.P$35 | 130.25,105.24 129.96,105.24 LTC1.P$36 | 132.56,92.44 132.81,92.44 134.53,94.17 134.53,94.64 C15.2 135.64,95.84 135.54,95.95 C2.2 135.54,99.38 135.27,99.65 135.27,103.72 130.75,108.24 130.43,108.24 | 132.56,92.44 132.56,89.86 LTC1_V-.P$1 | 130.43,108.24 LTC1.P$30 | 130.43,108.24 130.43,108.74 LTC1.P$29 129.03,108.74 129.03,109.24 | v140.36,93.72 140.36,93.61 142.33,91.63 148.18,91.63 148.83,92.28 148.83,92.84 C4.2 151.04,92.84 152.14,91.74 157.25,91.74 | 174.5,92.55 176.39,92.55 176.41,92.53 D18.A D17.A 181.35,92.53 181.55,92.33 D16.A | 174.5,92.55 174.5,93.11 174.45,93.15 166.33,93.15 164.91,91.74 157.25,91.74 | C14.2 174.5,92.55 | C5.2 151.04,95.63 | 128.57,109.74 128.41,109.74 127.65,110.49 127.65,112.46 143.99,128.79 194.37,128.79 L16.2 | 129.03,109.24 128.75,109.24 128.57,109.42 128.57,109.74 | LTC1.P$27 128.57,109.74 | LTC1.P$28 129.03,109.24 | 114.94,110.72 U$8.1
  Top 0.203: 114.94,110.72 U$8.4 U$8.7 U$8.10 U$8.13 U$8.16 | 114.94,110.72 107.86,110.72 IC1.15
  Bottom 0.203: 144.55,105.36 144.55,105.65 144.06,106.14 143.42,106.14 143.23,105.95 142.01,105.95 140.85,107.11 v140.85,111.27 | 144.55,105.36 144.55,104.94 144.06,104.46 143.33,104.46 142.92,104.87 141.96,104.87 140.36,103.27 v140.36,93.72 135.69,89.05 LTC1_V-.P$1 131.75,89.05 129.61,91.19 125.01,91.19 116,100.2 116,100.33 U$8.16 | 144.55,105.36 v145.25,105.36
  pour Bottom: 103.5,129.54 198.12,129.54 198.12,85.72 103.5,85.72
  pour Top: 103.5,129.54 198.12,129.54 198.12,85.72 103.5,85.72
GNDIO  (via drill 0.46 pad 0.86)
  Top 0.254: 49.12,68.27 49.12,63.85 49.32,63.64 C48.2 49.32,50.75 51.79,48.28 S2.1 | 49.12,68.27 48.63,68.76 38.73,68.76 ADC_POWER.2 38.73,70.94 37.64,70.94 35.36,73.22 27.68,73.22 27.48,73.03 27.48,71.32 | 51.22,68.27 49.12,68.27 | C16.2 27.61,118.88 26.83,118.88 24.79,116.84 | 24.79,116.84 24.79,96.79 14.79,86.8 13.72,86.8 AIN0.1 | 63.6,61.06 61.59,59.06 61.59,56.04 60.8,55.25 59.82,55.25 58.88,56.19 58.88,57.15 PIC_POWER.1 57.78,60.94 63.62,66.78 | 63.6,61.06 63.6,64.65 63.82,64.87 67.1,64.87 67.35,65.12 C22.2 | 63.6,61.06 68.9,61.06 78.05,70.21 78.05,74.47 78.69,75.11 PROGRAM.6 82.4,75.11 88.01,69.49 IC2_\.2 | 98.81,57.15 98.81,61.87 IC2_\.8 | 51.22,68.27 52.2,69.25 C1.2 53.33,70.48 54.42,69.39 54.42,69.32 U$2.8 | 51.22,68.27 51.22,66.86 51.67,66.4 52,66.4 U$3.2 | 63.62,66.78 63.62,76.94 U$2.27 | U$2.19 63.62,66.78 | 27.48,71.32 27.48,64.97 U$6.9 30.34,64.97 30.34,60.79 30.18,60.62 27.65,60.62 26.97,59.95 26.97,55.5 25.12,53.65 U$1.8 22.26,53.65 22.26,47.55 | 28.37,34.05 24.39,30.08 24.39,28.15 C51.2 20.24,28.15 16.83,31.55 | 28.37,34.05 28.91,34.59 30.92,34.59 31.46,35.13 C50.2 34.1,35.13 35.67,33.56 36.31,33.56 36.38,33.56 36.44,33.56 | 28.37,34.05 22.61,39.81 LED38.C LED37.C LED40.C 22.61,47.05 22.26,47.4 22.26,47.55 | AIN4.1 13.61,33.67 14.71,33.67 16.83,31.55 | 16.83,31.55 11.67,26.39 11.67,18.24 12V.1 | v100.79,28.18 98.94,26.33 98.94,26.31 IC3_.2 | 98.94,15.24 98.94,18.69 IC3_.8 | C52.2 34.59,25.75 35.13,25.21 38.41,25.21 | 40.23,26.71 40.23,26.47 38.97,25.21 38.41,25.21 | 22.26,47.55 15.69,47.55 AIN3.1 | 40.23,26.71 40.23,27.24 37.41,30.06 37.05,30.06 36.44,30.67 36.44,33.56
  Top 0.254: U$6.14 27.48,71.32 | 98.81,57.15 LTC2_HEAD.11 | LTC2_HEAD.12 98.81,57.15 | 98.68,99.69 LTC1_HEAD.11 | LTC1_HEAD.12 98.68,99.69 | 98.68,99.69 98.68,103.1 IC1.8 95.82,103.1 95.82,110.72 IC1.2 | 40.23,26.71 41.09,26.71 IC2.3 | C53.2 38.41,25.21 | 36.44,33.56 U$7.3 38.15,33.56 39.08,34.5 C49.2 | AIN1.1 13.72,71.8 11.74,69.83 11.74,62.3 12.64,61.4 13.72,61.4 AIN2.1 | 98.94,15.24 LTC3_HEAD.11 | LTC3_HEAD.12 98.94,15.24 | U$4.5 24.79,116.84
  Bottom 0.254: 82.4,75.11 97.16,60.35 LTC2_HEAD.12 | 82.4,75.11 95.71,88.42 95.71,97.27 97.04,98.6 97.16,98.6 LTC1_HEAD.12 | PIC_POWER.1 57.78,54.28 51.79,48.28 S2.1 S2.2 | PROGRAM.6 82.4,75.11 | AIN2.1 13.72,59.1 15.69,57.12 15.69,49.6 14.79,48.7 13.72,48.7 AIN3.1 | v100.79,28.18 100.79,17.43 99.69,16.33 LTC3_HEAD.11 | v100.79,28.18 100.79,55.1 99.83,56.06 99.69,56.06 LTC2_HEAD.11 | v100.79,28.18 | AIN0.1 13.72,84.5 15.72,82.5 15.72,74.95 AIN1.1
  pour Top: 0.64,130.18 102.23,130.18 102.23,0.64 0.64,0.64
  pour Bottom: 0.64,130.18 102.23,130.18 102.23,0.64 0.64,0.64
JACK2
  Top 0.254: RS-485.10 RS-485.9
  Bottom 0.254: 16.38,121.44 14.1,123.73 J19.2 | 16.38,121.44 39.52,121.44 43.99,116.98 43.99,116.84 RS-485.10 | J20.2 14.1,117.32 15.57,118.8 15.57,120.64 16.38,121.44
JACK3
  Top 0.254: RS-485.12 RS-485.11 | 21.93,115.57 20.33,113.97 20.33,108.59 J20.3 | 21.93,119.94 21.93,115.57 | U$4.6 21.93,115.57 | 21.93,119.94 23.69,121.7 24.26,121.7 R170.1 | J19.3 19.19,122.68 21.93,119.94
  Bottom 0.254: RS-485.12 46.53,116.84 46.53,116.95 40.8,122.68 J19.3
JACK4  (via drill 0.46)
  Top 0.254: 15.16,103.87 15.16,119.27 14.1,120.33 J19.4 | J20.4 14.93,103.63 15.16,103.87 | 15.16,103.87 17.12,103.87 21.93,108.67 21.93,114.3 U$4.7 | RS-485.13 RS-485.14 50.06,116.89 42.98,123.98 26.59,123.98 26.44,123.83 | 26.44,123.83 26.36,123.75 26.36,122.76 24.31,120.7 24.31,120.02 R170.2 | v25.98,124.28 26.36,123.9 26.44,123.83
  Bottom 0.254: v25.98,124.28 24.31,124.28 23.93,123.9 15.62,123.9 14.48,125.04 13.72,125.04 13.03,124.36 13.03,122.53 14.1,121.46 J19.4
JACK5
  Bottom 0.254: J20.5 15.6,103.4 15.6,117.37 15.64,117.4 15.64,117.41 16.64,118.41 | RS-485.15 52.7,115.39 52.34,115.39 51.31,116.42 | 51.31,116.42 51.61,116.73 51.61,116.84 RS-485.16 | 16.64,118.41 40,118.41 41.45,116.95 41.45,116.35 42.13,115.67 50.55,115.67 51.31,116.42 | 16.64,118.41 J19.5
LED2
  Top 0.254: LED_SWITCH.3 57.15,39.55 55.68,38.07 40.53,38.07 32.63,45.97 R158.2
LTC_1_CS
  Top 0.254: SV3.27 69.85,84 71.18,82.66 71.18,73.45 69.59,71.86 U$2.23 | SV3.28 SV4.27 SV4.28
  Bottom 0.254: SV3.28 SV3.27
LTC_1_CS_ISO
  Top 0.254: IC1.5 98.68,106.91 101.86,103.73 101.86,92.66 99.83,90.63 99.69,90.63 LTC1_HEAD.3 LTC1_HEAD.4
LTC_1_MISO
  Top 0.254: U$2.14 57.28,61.7 59.92,64.34 59.92,83.76 59.69,84 SV3.19 SV3.20 SV4.19 SV4.20
LTC_1_MISO_ISO
  Top 0.254: LTC1_HEAD.1 98.6,87 98.06,87.54 97.16,87.54 | 97.16,87.54 97.16,88.09 97.02,88.09 96.04,89.06 96.04,92.59 96.8,93.34 99.97,93.34 101.36,94.72 101.36,102.97 98.68,105.64 IC1.6 | LTC1_HEAD.2 97.16,87.54
LTC_2_CS
  Top 0.254: U$2.24 70.09,73.13 70.68,73.71 70.68,80.63 67.31,84 SV3.25 SV3.26 SV4.25 SV4.26
LTC_2_CS_ISO
  Top 0.254: IC2_\.5 95.95,65.68 95.41,65.15 95.41,54.73 96.8,53.34 100.02,53.34 100.81,52.55 100.81,49.08 99.81,48.08 99.69,48.08 LTC2_HEAD.3
LTC_2_MISO
  Top 0.254: U$2.15 66.48,61.7 | 66.48,61.7 68.82,61.7 77.29,70.16 77.29,76.19 85.09,84 SV3.39 | 66.48,61.7 | SV3.40 SV4.39 SV4.40
  Bottom 0.254: SV3.40 SV3.39
LTC_2_MISO_ISO  (via drill 0.46 pad 0.86)
  Top 0.254: IC2_\.6 95.95,64.41 95.95,61.42 97.63,59.74 v97.98,59.74
  Bottom 0.254: 98.26,44.45 LTC2_HEAD.1 | LTC2_HEAD.2 98.26,44.45 | 98.26,44.45 98.26,59.46 v97.98,59.74
LTC_3_CS  (via drill 0.46 pad 0.86)
  Top 0.254: U$2.25 66.48,74.4 67.55,75.47 v67.55,76.71 | SV3.23 SV3.24 SV4.23 SV4.24
  Bottom 0.254: v67.55,76.71 64.77,79.49 SV3.23
LTC_3_CS_ISO
  Top 0.254: 96.05,22.5 95.56,22.99 95.56,44.44 97.02,45.9 97.16,45.9 LTC2_HEAD.4 | 96.05,22.5 95,21.46 95,3.15 96.73,1.42 100.17,1.42 100.82,2.07 100.82,2.97 99.81,3.99 99.69,3.99 LTC3_HEAD.3 LTC3_HEAD.4 | 96.05,22.5 96.08,22.5 IC3_.5
LTC_3_MISO
  Top 0.254: U$2.16 69.37,62.97 76.78,70.37 76.78,78.23 82.55,84 SV3.37 | SV3.38 SV4.37 SV4.38
  Bottom 0.254: SV3.38 SV3.37
LTC_3_MISO_ISO
  Top 0.254: LTC3_HEAD.1 98.6,2.54 98.06,3.09 97.16,3.09 | 97.16,3.09 97.16,3.63 97.02,3.63 95.51,5.14 95.51,20.66 96.08,21.23 IC3_.6 | LTC3_HEAD.2 97.16,3.09
MCLR  (via drill 0.46 pad 0.86)
  Top 0.254: v53.05,72.42 51.9,72.42 50.53,71.05 50.53,70.48 C1.1 | v72.03,72.86 72.34,73.17 R53.1 72.34,75.32 72.34,75.93 72.34,76.67 72.39,76.72 R52.2
  Bottom 0.254: v72.03,72.86 53.48,72.86 v53.05,72.42 | v72.03,72.86 75.86,72.86 78.69,70.03 PROGRAM.4 | v72.03,72.86
MOSI
  Top 0.254: U$2.6 54.42,71.86 54.42,72.2 53.22,73.4 46.21,73.4 35.2,84.41 35.2,96.58 36.15,97.53 44.37,97.53 45.9,96 45.9,95.89 SV4.10 SV4.9 SV3.10 SV3.9
MOSI_ADC
  Top 0.254: ADC_BITS.5 37.47,57.61 37.35,57.61 34.41,60.54 34.41,63.44 30.34,67.51 U$6.11
  Bottom 0.254: ADC_BITS.6 ADC_BITS.5
MOSI_ISO1  (via drill 0.46 pad 0.86)
  Top 0.254: v99.42,108.92 98.68,108.18 IC1.4 | LTC1_HEAD.6 LTC1_HEAD.5
  Bottom 0.254: v99.42,108.92 100.83,107.52 100.83,94.16 99.83,93.17 99.69,93.17 LTC1_HEAD.5
MOSI_ISO2
  Top 0.254: LTC2_HEAD.5 98.6,49.53 98.06,50.08 97.16,50.08 | 97.16,50.08 97.16,50.62 97.04,50.62 94.9,52.76 94.9,65.91 95.95,66.95 IC2_\.4 | LTC2_HEAD.6 97.16,50.08
MOSI_ISO3
  Top 0.254: LTC3_HEAD.6 LTC3_HEAD.5 99.69,8.71 99.83,8.71 100.79,9.67 100.79,21.92 98.94,23.77 IC3_.4
N$1  (via drill 0.46 pad 0.86)
  Top 0.254: U$2.1 54.42,78.21 48.26,84.37 48.26,96.17 46.38,98.04 35.92,98.04 31.75,93.87 MCLR.1 MCLR.2 MCLR.3 | R53.2 68.36,74.7 67.96,74.3 v67.59,74.3
  Bottom 0.254: v67.59,74.3 63.85,74.3 53.34,84.81 53.34,85.43 52.59,86.18 51.92,86.18 50.88,87.23 50.88,87.83 45.72,92.98 45.72,93.67 44.95,94.44 32.39,94.44 31.75,93.8 MCLR.1
N$2
  Top 0.254: R104.2 118.21,76.06 117,74.85 117,71.92 117.97,70.94 118.11,70.94 U$9.5
N$3
  Top 0.254: 47.27,44.55 S2.3 | S2.4 47.27,44.55 | 47.27,44.55 56.53,44.55 57.15,45.17 | 57.15,45.17 57.3,45.33 R1.1 | LED_SWITCH.1 57.15,45.17
N$4
  Top 0.254: K1.2 54.66,2.23 64.08,2.23 65.51,3.67 T1.3
N$5
  Top 0.254: R155.2 118.08,31.74 117,30.65 117,28.74 117.97,27.76 118.11,27.76 U$10.5
N$6
  Top 0.254: J19.1 16.64,124.23 15.6,123.19 15.6,119.72 16.64,118.68 J20.1
N$8
  pour Bottom: 10.16,10.79 10.16,2.54 37.47,2.54 37.47,14.61 18.41,14.61 18.41,11.43 10.16,11.43
N$9
  Top 0.203: 137.13,101.74 | LTC1.P$2 137.13,101.74 | 137.13,102.74 | 137.13,102.74 137.13,101.74 | 137.13,101.74 | 137.13,102.74 | LTC1.P$4 137.01,102.74 137.13,102.74 | LTC1.P$6 136.9,103.74 137.13,103.52 137.13,102.74 | 137.13,101.74 137.13,98.84 142.32,93.65 LTC1_C10.P$1 C4.1
  Bottom 0.203: D6.C 167.57,92.91 166.29,91.63 148.99,91.63 148.2,92.42 148.2,92.84 R10.2 LTC1_C10.P$1
N$10
  Top 0.254: U$8.5 117.47,111.58 117.36,111.58 116.35,112.59 116.35,115.04 117.37,116.07 R5.2
N$11
  pour Top: 10.16,11.43 10.16,2.54 37.47,2.54 37.47,14.61 18.41,14.61 18.41,11.43
N$18
  Top 0.254: J20.6 13.04,102.15 13.04,117.82 J19.6
N$20  (via drill 0.46 pad 0.86)
  Top 0.254: Q3.2 178.48,97.17 177.86,97.78 v173.74,97.78 | L5.2 196.72,90.09 195.78,90.09 193.5,87.81 185.81,87.81 184.51,89.11 184.51,92.69 183.39,93.82 v162.16,93.82
  Bottom 0.254: v173.74,97.78 169.95,93.99 162.33,93.99 v162.16,93.82 161.18,92.84 R10.1
N$21  (via drill 0.46 pad 0.86)
  Top 0.203: v128.35,99.72 128.57,99.94 128.57,101.24 LTC1.P$44 | IC1.12 107.86,106.91 107.86,106.68 v110.2,104.33
  Bottom 0.203: v128.35,99.72 127.89,99.26 119.55,99.26 118.95,99.86 118.95,100.43 117.57,101.8 112.73,101.8 v110.2,104.33
N$23
  Top 0.203: IC1.13 107.86,108.18 111.3,104.73 111.3,101.78 114.31,98.77 124.67,98.77 128.15,102.24 LTC1.P$42
N$24
  Top 0.203: LTC1.P$41 127.67,102.74 124.16,99.23 114.51,99.23 111.76,101.98 111.76,105.55 107.86,109.45 IC1.14
N$25
  Top 0.203: R11.2 155,92.96 153.73,94.23 LTC1_S10.P$1 142.49,94.23 137.59,99.14 137.59,103.78 137.13,104.24 LTC1.P$7
N$26
  Top 0.254: Q3.1 179.26,96 178.79,96 177.84,96.95 164.06,96.95 160.08,92.96 R11.1
N$27
  Top 0.254: Q3.3 177.26,95.48 178.37,94.38 183.55,94.38 185.54,92.39 185.54,92.12 185.99,91.67 186.86,91.67 R12.2
N$28
  Bottom 1.27: 8.89,12.7 8.89,1.27 38.73,1.27 38.73,15.88 17.14,15.88 17.14,12.7 8.89,12.7
N$29  (via drill 0.46 pad 0.86)
  Top 0.254: v152.17,96.09 153.68,97.6 159.69,97.6 162.56,100.47 Q4.2 180.21,100.47 184.74,95.94 187.72,95.94 191.23,92.42 191.23,89.74 R12.1 193.69,89.74 193.69,92.79 195.59,94.69 L6.2
  Bottom 0.254: R14.1 151.71,95.63 v152.17,96.09
N$30
  Top 0.203: LTC1.P$31 130.58,107.74 133.84,104.48 133.84,96.85 132.84,95.84 C15.1
N$31
  Top 0.203: LTC1.P$8 137.28,104.74 138.04,103.97 138.04,100.72 142.32,96.44 LTC1_C9.P$1 C5.1
  Bottom 0.203: 164.02,95.45 153.21,95.45 152.19,94.42 148.99,94.42 148.2,95.22 148.2,95.63 R14.2 LTC1_C9.P$1 | 164.02,95.45 | 164.02,95.45 D7.C 167.21,95.45 167.57,95.81 D6.A
N$32
  Top 1.27: 8.89,12.7 17.14,12.7 17.14,15.88 38.73,15.88 38.73,1.27 8.89,1.27 8.89,12.7
N$33  (via drill 0.46 pad 0.86)
  other vias: 204.39,91.91
  pour Top: 198.75,130.18 198.75,87 227.33,87 227.33,130.18
  pour Bottom: 198.75,130.18 198.75,87 227.33,87 227.33,130.18
N$34  (via drill 0.46 pad 0.86)
  Top 0.203: LTC1_S9.P$1 142.67,96.9 138.5,101.07 138.5,104.16 137.42,105.24 LTC1.P$9 | R15.2 154.45,96.27 v154.18,96.54
  Bottom 0.203: v154.18,96.54 153.82,96.9 144.4,96.9 LTC1_S9.P$1
N$35
  Top 0.254: Q4.1 178.48,98.57 178.45,98.59 162.41,98.59 160.08,96.27 R15.1
N$36
  Top 0.254: R16.2 185.63,93.8 179.92,99.52 Q4.3
N$37  (via drill 0.46 pad 0.86)
  other vias: 201.38,52.17
  pour Bottom: 198.75,85.09 227.33,85.09 227.33,44.45 198.75,44.45
  pour Top: 198.75,85.09 227.33,85.09 227.33,44.45 198.75,44.45
N$38  (via drill 0.46 pad 0.86)
  Top 0.254: v152.69,100.66 153.29,101.26 160.16,101.26 162.67,103.77 Q5.2 180.04,103.77 184.01,99.8 187.98,99.8 189.41,98.37 189.41,97.89 192.07,95.23 192.95,95.23 | 192.95,95.23 195.59,97.87 L7.2 | 192.95,95.23 192.95,93.8 R16.1
  Bottom 0.254: v152.69,100.66 151.07,99.03 151.07,98.42 R18.1
N$39  (via drill 0.46 pad 0.86)
  other vias: 200.08,0.95
  pour Top: 198.75,42.55 227.33,42.55 227.33,0.64 198.75,0.64
  pour Bottom: 198.75,42.55 227.33,42.55 227.33,0.64 198.75,0.64
N$40
  Top 0.203: LTC1.P$10 137.13,105.74 137.57,105.74 138.96,104.35 138.96,102.59 142.32,99.24 LTC1_C8.P$1 C6.1
  Bottom 0.203: LTC1_C8.P$1 R18.2 148.2,98.42 148.2,98.92 148.91,99.63 150.51,99.63 152.32,101.44 160.92,101.44 164.02,98.35 D7.A 167.43,98.35 167.57,98.5 D8.C
N$43
  Top 0.203: R19.2 155,99.44 154.91,99.35 151.59,99.35 151.12,99.82 LTC1_S8.P$1 142.53,99.82 139.42,102.93 139.42,104.54 137.72,106.24 LTC1.P$11
N$44
  Top 0.254: Q5.1 178.48,101.87 162.51,101.87 160.08,99.44 R19.1
N$45
  Top 0.254: Q5.3 179.96,102.82 184.91,97.87 185.63,97.87 R20.2
N$47  (via drill 0.46 pad 0.86)
  Top 0.254: 182.64,103.86 183.17,104.39 184.38,104.39 184.91,103.86 187.95,103.86 191.23,100.58 191.23,97.87 R20.1 193.08,97.87 193.69,97.87 193.69,99.14 195.59,101.04 L8.2 | 182.64,103.86 182.47,103.86 Q6.2 | v182.64,103.69 182.64,103.86
  Bottom 0.254: R22.1 145.96,101.22 145.96,101.36 143.99,103.33 143.2,103.33 141.48,101.61 141.48,92.45 142.78,91.15 170.1,91.15 v182.64,103.69
N$49
  Top 0.203: LTC1.P$12 137.86,106.74 139.87,104.73 139.87,103.66 LTC1_C7.P$1 C7.1
  Bottom 0.203: D8.A 167.57,101.4 167.21,101.04 D9.C 164.02,101.04 163.16,101.9 151.72,101.9 151.04,101.22 R22.2 148.83,101.22 148.83,100.81 148.04,100.01 144.91,100.01 143.71,101.22 LTC1_C7.P$1
N$52
  Top 0.203: LTC1.P$13 138.01,107.24 140.33,104.92 140.33,104.5 142.34,102.49 LTC1_S7.P$1 154.88,102.49 155,102.62 R23.2
N$53
  Top 0.254: Q6.1 179.26,105.9 178.86,105.9 177.91,106.85 164.32,106.85 160.08,102.62 R23.1
N$54  (via drill 0.46 pad 0.86)
  Top 0.254: R24.2 185.63,101.93 185.63,101.99 v184.04,103.57 | v177.61,104.74 177.26,105.08 Q6.3
  Bottom 0.254: v184.04,103.57 182.88,104.74 v177.61,104.74
N$56  (via drill 0.46 pad 0.86)